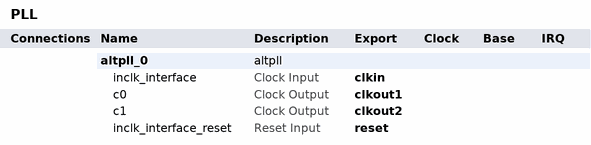
[diagram p0: system contents]
# Platform Designer (Qsys) system PLL, Cyclone IV E EP4CE115F29C7
# Parameters at their usual value, and those the tool derives, are not listed.
package require qsys
create_system PLL
set_project_property DEVICE_FAMILY {Cyclone IV E}
set_project_property DEVICE EP4CE115F29C7

add_instance altpll_0 altpll 12.1
set_instance_parameter_value altpll_0 INCLK0_INPUT_FREQUENCY 20000
set_instance_parameter_value altpll_0 CLK0_MULTIPLY_BY 54
set_instance_parameter_value altpll_0 CLK1_MULTIPLY_BY 54
set_instance_parameter_value altpll_0 CLK0_DIVIDE_BY 25
set_instance_parameter_value altpll_0 CLK1_DIVIDE_BY 25
set_instance_parameter_value altpll_0 CLK1_PHASE_SHIFT 0
set_instance_parameter_value altpll_0 CLK1_DUTY_CYCLE 50
set_instance_parameter_value altpll_0 PORT_clk1 PORT_USED
set_instance_parameter_value altpll_0 PORT_clk2 PORT_UNUSED
set_instance_parameter_value altpll_0 PORT_clk3 PORT_UNUSED
set_instance_parameter_value altpll_0 PORT_ARESET PORT_UNUSED
set_instance_parameter_value altpll_0 PORT_LOCKED PORT_UNUSED

# exported interfaces
add_interface clkin clock sink
set_interface_property clkin EXPORT_OF altpll_0.inclk_interface
add_interface reset reset sink
set_interface_property reset EXPORT_OF altpll_0.inclk_interface_reset
add_interface clkout1 clock source
set_interface_property clkout1 EXPORT_OF altpll_0.c0
add_interface clkout2 clock source
set_interface_property clkout2 EXPORT_OF altpll_0.c1

save_system PLL.qsys
